# EAGLE design Numpad (EAGLE 9.3.0)
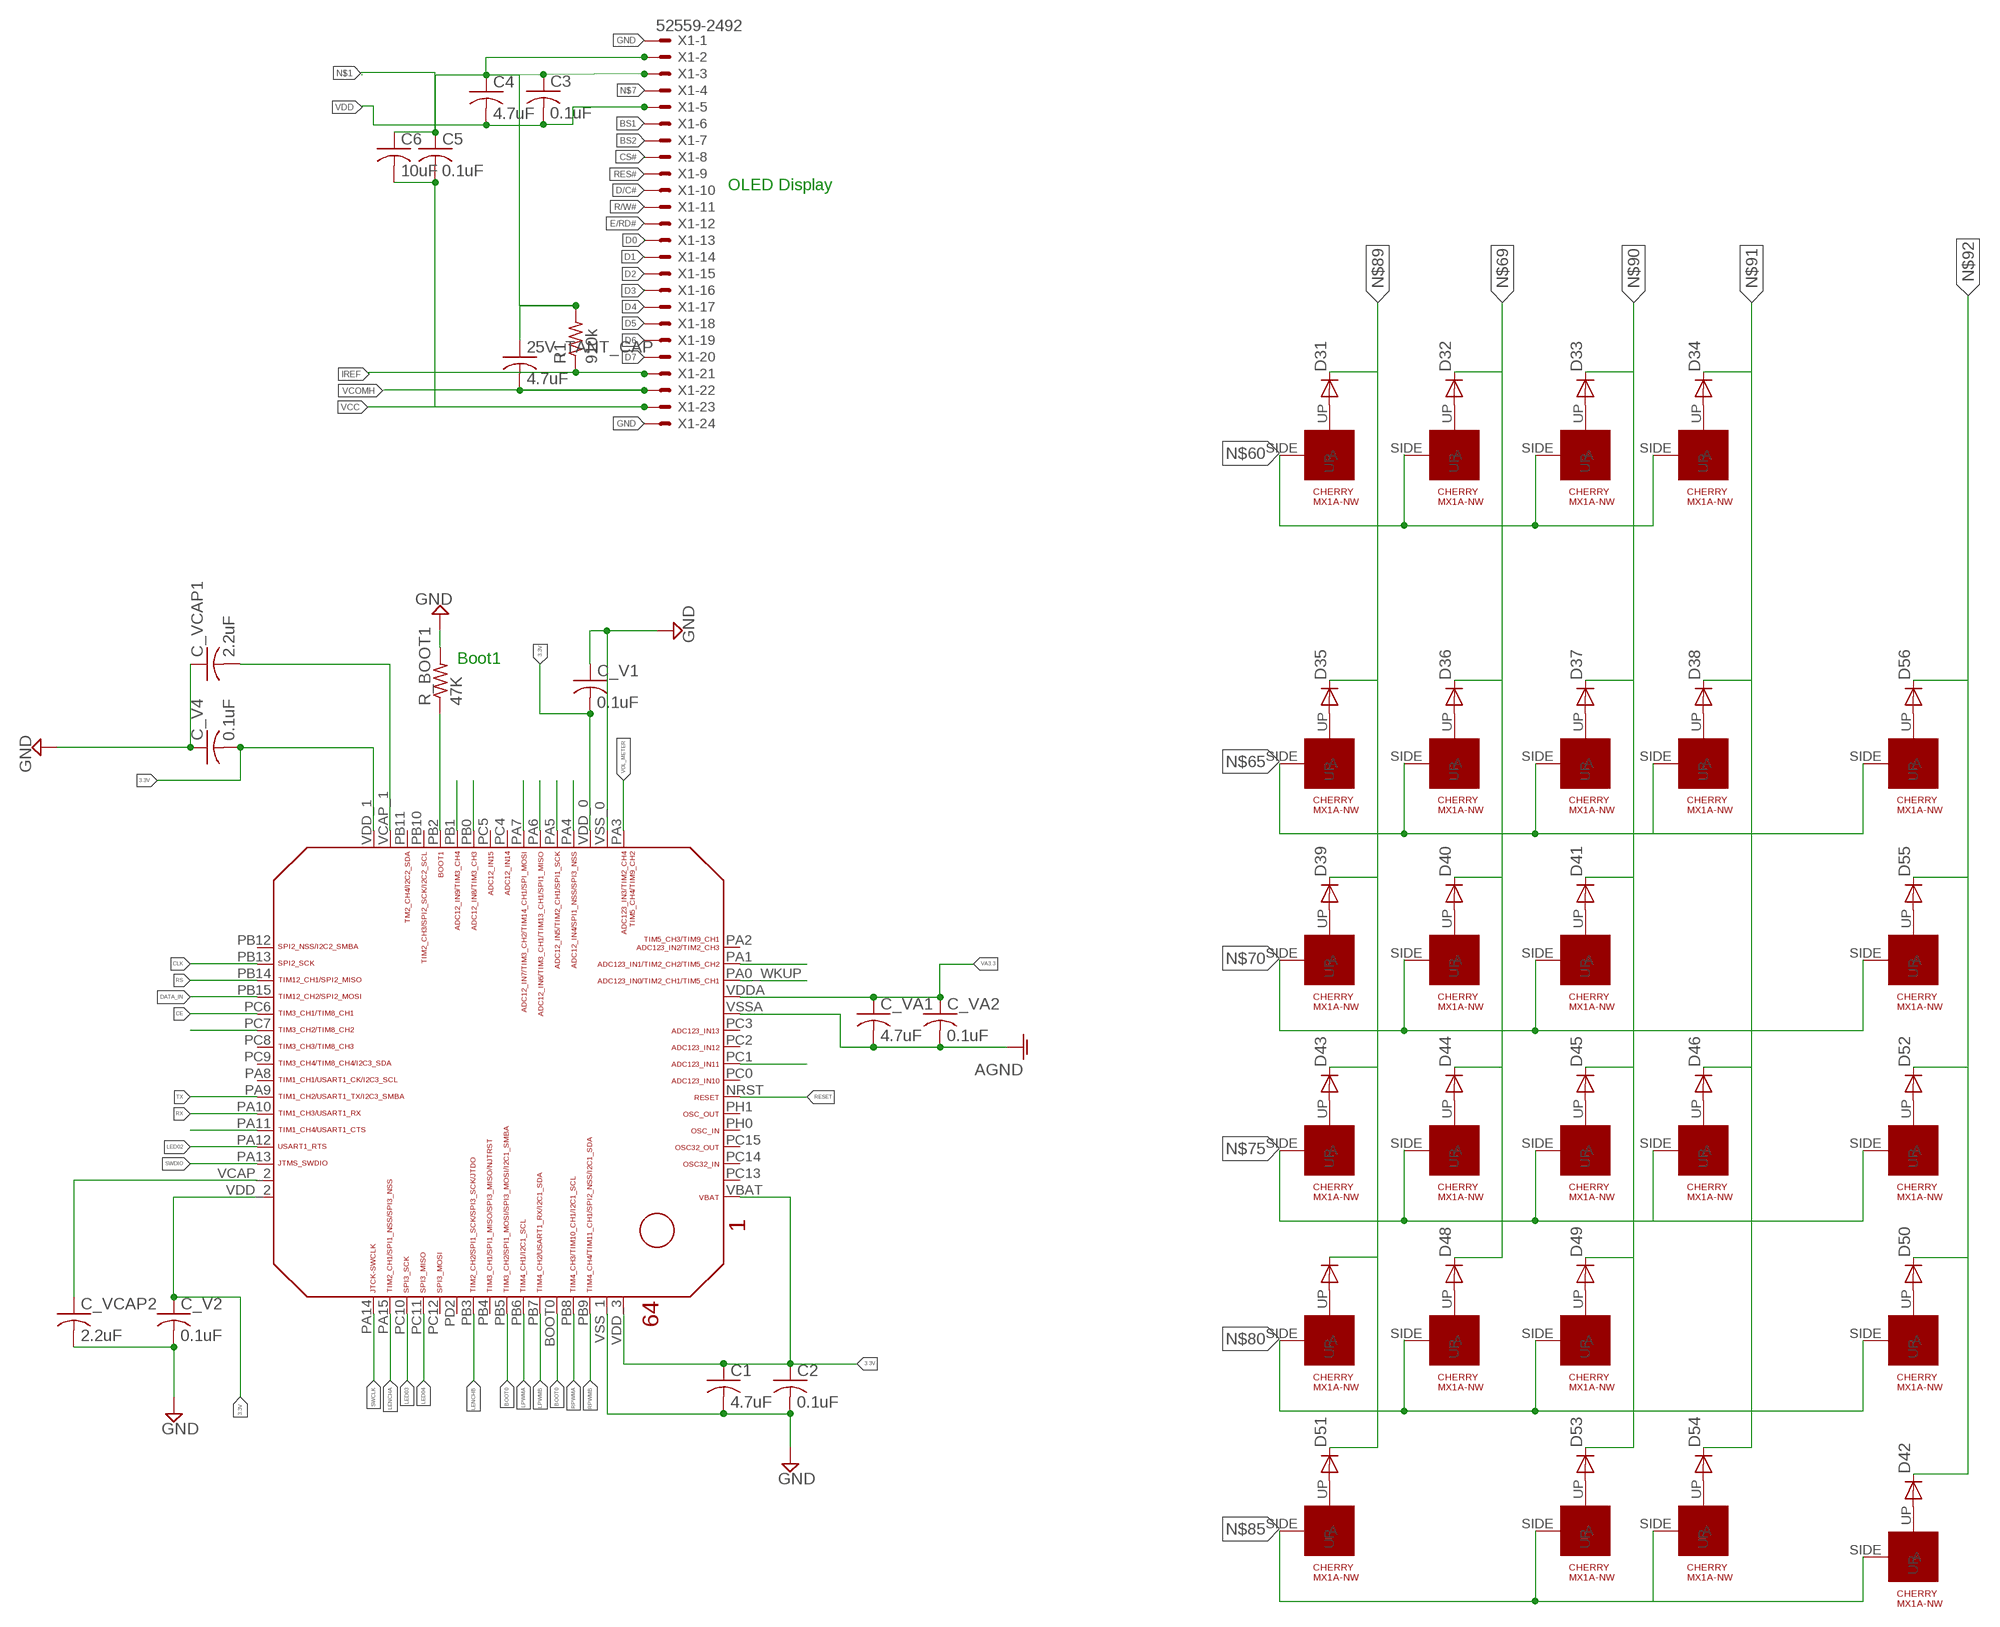
[diagram p0: schematic, sheet 1]

## Parts
25V_TANT_CAP  4.7uF  C-USC0805  [C0805]
C1  4.7uF  C-USC0603  [C0603]
C2  0.1uF  C-USC0603  [C0603]
C3  0.1uF  C-USC0603  [C0603]
C4  4.7uF  C-USC0603  [C0603]
C5  0.1uF  C-USC0603  [C0603]
C6  10uF  C-USC0603  [C0603]
C_V1  0.1uF  C-USC0603  [C0603]
C_V2  0.1uF  C-USC0603  [C0603]
C_V4  0.1uF  C-USC0603  [C0603]
C_VA1  4.7uF  C-USC0603  [C0603]
C_VA2  0.1uF  C-USC0603  [C0603]
C_VCAP1  2.2uF  C-USC0603  [C0603]
C_VCAP2  2.2uF  C-USC0603  [C0603]
D31  1N4148DO35-7  [DO35-7]
D32  1N4148DO35-7  [DO35-7]
D33  1N4148DO35-7  [DO35-7]
D34  1N4148DO35-7  [DO35-7]
D35  1N4148DO35-7  [DO35-7]
D36  1N4148DO35-7  [DO35-7]
D37  1N4148DO35-7  [DO35-7]
D38  1N4148DO35-7  [DO35-7]
D39  1N4148DO35-7  [DO35-7]
D40  1N4148DO35-7  [DO35-7]
D41  1N4148DO35-7  [DO35-7]
D42  1N4148DO35-7  [DO35-7]
D43  1N4148DO35-7  [DO35-7]
D44  1N4148DO35-7  [DO35-7]
D45  1N4148DO35-7  [DO35-7]
D46  1N4148DO35-7  [DO35-7]
D47  1N4148DO35-7  [DO35-7]
D48  1N4148DO35-7  [DO35-7]
D49  1N4148DO35-7  [DO35-7]
D50  1N4148DO35-7  [DO35-7]
D51  1N4148DO35-7  [DO35-7]
D52  1N4148DO35-7  [DO35-7]
D53  1N4148DO35-7  [DO35-7]
D54  1N4148DO35-7  [DO35-7]
D55  1N4148DO35-7  [DO35-7]
D56  1N4148DO35-7  [DO35-7]
R1  910k  R-US_R0603  [R0603]
R_BOOT1  47K  R-US_R0603  [R0603]
U$31  CHERRY-MX1A-E1NW  [CHERRYMX-NN]
U$35  STM32F405/415_LQFP64  [STM32F405/415_LQFP64]
U$36  CHERRY-MX1A-E1NW  [CHERRYMX-NN]
U$37  CHERRY-MX1A-E1NW  [CHERRYMX-NN]
U$38  CHERRY-MX1A-E1NW  [CHERRYMX-NN]
U$39  CHERRY-MX1A-E1NW  [CHERRYMX-NN]
U$40  CHERRY-MX1A-E1NW  [CHERRYMX-NN]
U$41  CHERRY-MX1A-E1NW  [CHERRYMX-NN]
U$42  CHERRY-MX1A-E1NW  [CHERRYMX-NN]
U$43  CHERRY-MX1A-E1NW  [CHERRYMX-NN]
U$44  CHERRY-MX1A-E1NW  [CHERRYMX-NN]
U$45  CHERRY-MX1A-E1NW  [CHERRYMX-NN]
U$46  CHERRY-MX1A-E1NW  [CHERRYMX-NN]
U$47  CHERRY-MX1A-E1NW  [CHERRYMX-NN]
U$48  CHERRY-MX1A-E1NW  [CHERRYMX-NN]
U$49  CHERRY-MX1A-E1NW  [CHERRYMX-NN]
U$50  CHERRY-MX1A-E1NW  [CHERRYMX-NN]
U$51  CHERRY-MX1A-E1NW  [CHERRYMX-NN]
U$52  CHERRY-MX1A-E1NW  [CHERRYMX-NN]
U$53  CHERRY-MX1A-E1NW  [CHERRYMX-NN]
U$54  CHERRY-MX1A-E1NW  [CHERRYMX-NN]
U$55  CHERRY-MX1A-E1NW  [CHERRYMX-NN]
U$56  CHERRY-MX1A-E1NW  [CHERRYMX-NN]
U$57  CHERRY-MX1A-E1NW  [CHERRYMX-NN]
U$58  CHERRY-MX1A-E1NW  [CHERRYMX-NN]
U$59  CHERRY-MX1A-E1NW  [CHERRYMX-NN]
U$60  CHERRY-MX1A-E1NW  [CHERRYMX-NN]
X1  52559-2492  [52559-2492]

## Nets
3.3V: C1.1 C2.1 C_V1.2 C_V2.1 C_V4.2 U$35.VBAT U$35.VDD_0 U$35.VDD_1 U$35.VDD_2 U$35.VDD_3
AGND: C_VA1.2 C_VA2.2 U$35.VSSA
BOOT0: U$35.BOOT0 U$35.PB5
BS1: X1.6
BS2: X1.7
BUZZER: U$35.PA6
CE: U$35.PC6
CLK: U$35.PB13
CS#: X1.8
D0: X1.13
D1: X1.14
D2: X1.15
D3: X1.16
D4: X1.17
D5: X1.18
D6: X1.19
D7: X1.20
D/C#: X1.10
DATA_IN: U$35.PB15
DIAGONAL_EMITTER: U$35.PA7
E/RD#: X1.12
GND: C1.2 C2.2 C_V1.1 C_V2.2 C_V4.1 C_VCAP1.1 C_VCAP2.2 R_BOOT1.2 U$35.VSS_0 U$35.VSS_1 X1.1 X1.24
IREF: R1.1 X1.21
L_RECEIVER: U$35.PB0
LED01: U$35.PA11
LED02: U$35.PA12
LED03: U$35.PC10
LED04: U$35.PC11
LENCHA: U$35.PA15
LENCHB: U$35.PB3
LF_EMITTER: U$35.PC7
LF_RECEIVER: U$35.PB1
LPWMA: U$35.PB6
LPWMB: U$35.PB7
N$7: X1.4
N$45: R_BOOT1.1 U$35.PB2
N$54: D31.A U$31.UP
N$55: C_VCAP1.2 U$35.VCAP_1
N$56: C_VCAP2.1 U$35.VCAP_2
N$57: D32.A U$36.UP
N$58: D33.A U$37.UP
N$59: D34.A U$38.UP
N$60: U$31.SIDE(A) U$36.SIDE(A) U$37.SIDE(A) U$38.SIDE(A)
N$61: D35.A U$39.UP
N$62: D36.A U$40.UP
N$63: D37.A U$41.UP
N$64: D38.A U$42.UP
N$65: U$39.SIDE(A) U$40.SIDE(A) U$41.SIDE(A) U$42.SIDE(A) U$60.SIDE(A)
N$66: D39.A U$43.UP
N$67: D40.A U$44.UP
N$68: D41.A U$45.UP
N$69: D32.C D36.C D40.C D44.C D48.C
N$70: U$43.SIDE(A) U$44.SIDE(A) U$45.SIDE(A) U$59.SIDE(A)
N$71: D43.A U$47.UP
N$72: D44.A U$48.UP
N$73: D45.A U$49.UP
N$74: D46.A U$50.UP
N$75: U$47.SIDE(A) U$48.SIDE(A) U$49.SIDE(A) U$50.SIDE(A) U$56.SIDE(A)
N$76: D47.A U$51.UP
N$77: D48.A U$52.UP
N$78: D49.A U$53.UP
N$79: D42.A U$46.UP
N$80: U$51.SIDE(A) U$52.SIDE(A) U$53.SIDE(A) U$54.SIDE(A)
N$81: D51.A U$55.UP
N$82: D50.A U$54.UP
N$83: D53.A U$57.UP
N$84: D54.A U$58.UP
N$85: U$46.SIDE(A) U$55.SIDE(A) U$57.SIDE(A) U$58.SIDE(A)
N$86: D52.A U$56.UP
N$87: D55.A U$59.UP
N$88: D56.A U$60.UP
N$89: D31.C D35.C D39.C D43.C D47.C D51.C
N$90: D33.C D37.C D41.C D45.C D49.C D53.C
N$91: D34.C D38.C D46.C D54.C
N$92: D42.C D50.C D52.C D55.C D56.C
R/W#: X1.11
R_RECEIVER: U$35.PA5
RENCHA: U$35.PA0_WKUP(PA0_AKUP)
RENCHB: U$35.PA1
RES#: X1.9
RESET: U$35.NRST
RF_EMITTER: U$35.PC1
RF_RECEIVER: U$35.PA4
RPWMA: U$35.PB8
RPWMB: U$35.PB9
RS: U$35.PB14
RX: U$35.PA10
SWCLK: U$35.PA14
SWDIO: U$35.PA13
TX: U$35.PA9
VA3.3: C_VA1.1 C_VA2.1 U$35.VDDA
VCC: C5.2 C6.2 X1.23
VCOMH: 25V_TANT_CAP.2 X1.22
VDD: C3.2 C4.2 X1.5
VLSS: 25V_TANT_CAP.1 C3.1 C4.1 C5.1 C6.1 R1.2 X1.2 X1.3
VOL_METER: U$35.PA3
Unconnected: U$35.PA2 U$35.PA8 U$35.PB4 U$35.PB10 U$35.PB11 U$35.PB12 U$35.PC0 U$35.PC2 U$35.PC3 U$35.PC4 U$35.PC5 U$35.PC8 U$35.PC9 U$35.PC12 U$35.PC13 U$35.PC14 U$35.PC15 U$35.PD2 U$35.PH0 U$35.PH1

## Notes on the sheet
- OLED Display
- Boot1

## Library data of the parts
25V_TANT_CAP = rcl:C-US: CAPACITOR, American symbol; SPICEPREFIX: C
C1-C6 C_V1 C_V2 C_V4 C_VA1 C_VA2 C_VCAP1 C_VCAP2 = resistor:C-US: CAPACITOR, American symbol
D31-D56 = diode:1N4148: DIODE high speed (Philips)
R1 R_BOOT1 = resistor:R-US_: RESISTOR, American symbol
U$31 U$36-U$60 = my_parts:CHERRY-MX1A-E1NW: Cherry MX NW key
U$35 = STM32F10x F4xx:STM32F405/415_LQFP64
X1 = con-molex:52559-2492: FFC/FPC-to-Board 0.50mm (.020") SMT, Vertical, ZIF Receptacle Source: http://www.molex.com/product/ffc/52559.html; MF: MOLEX; MPN: 52559-2492; OC_FARNELL: unknown; OC_NEWARK: 25M4409

## Board
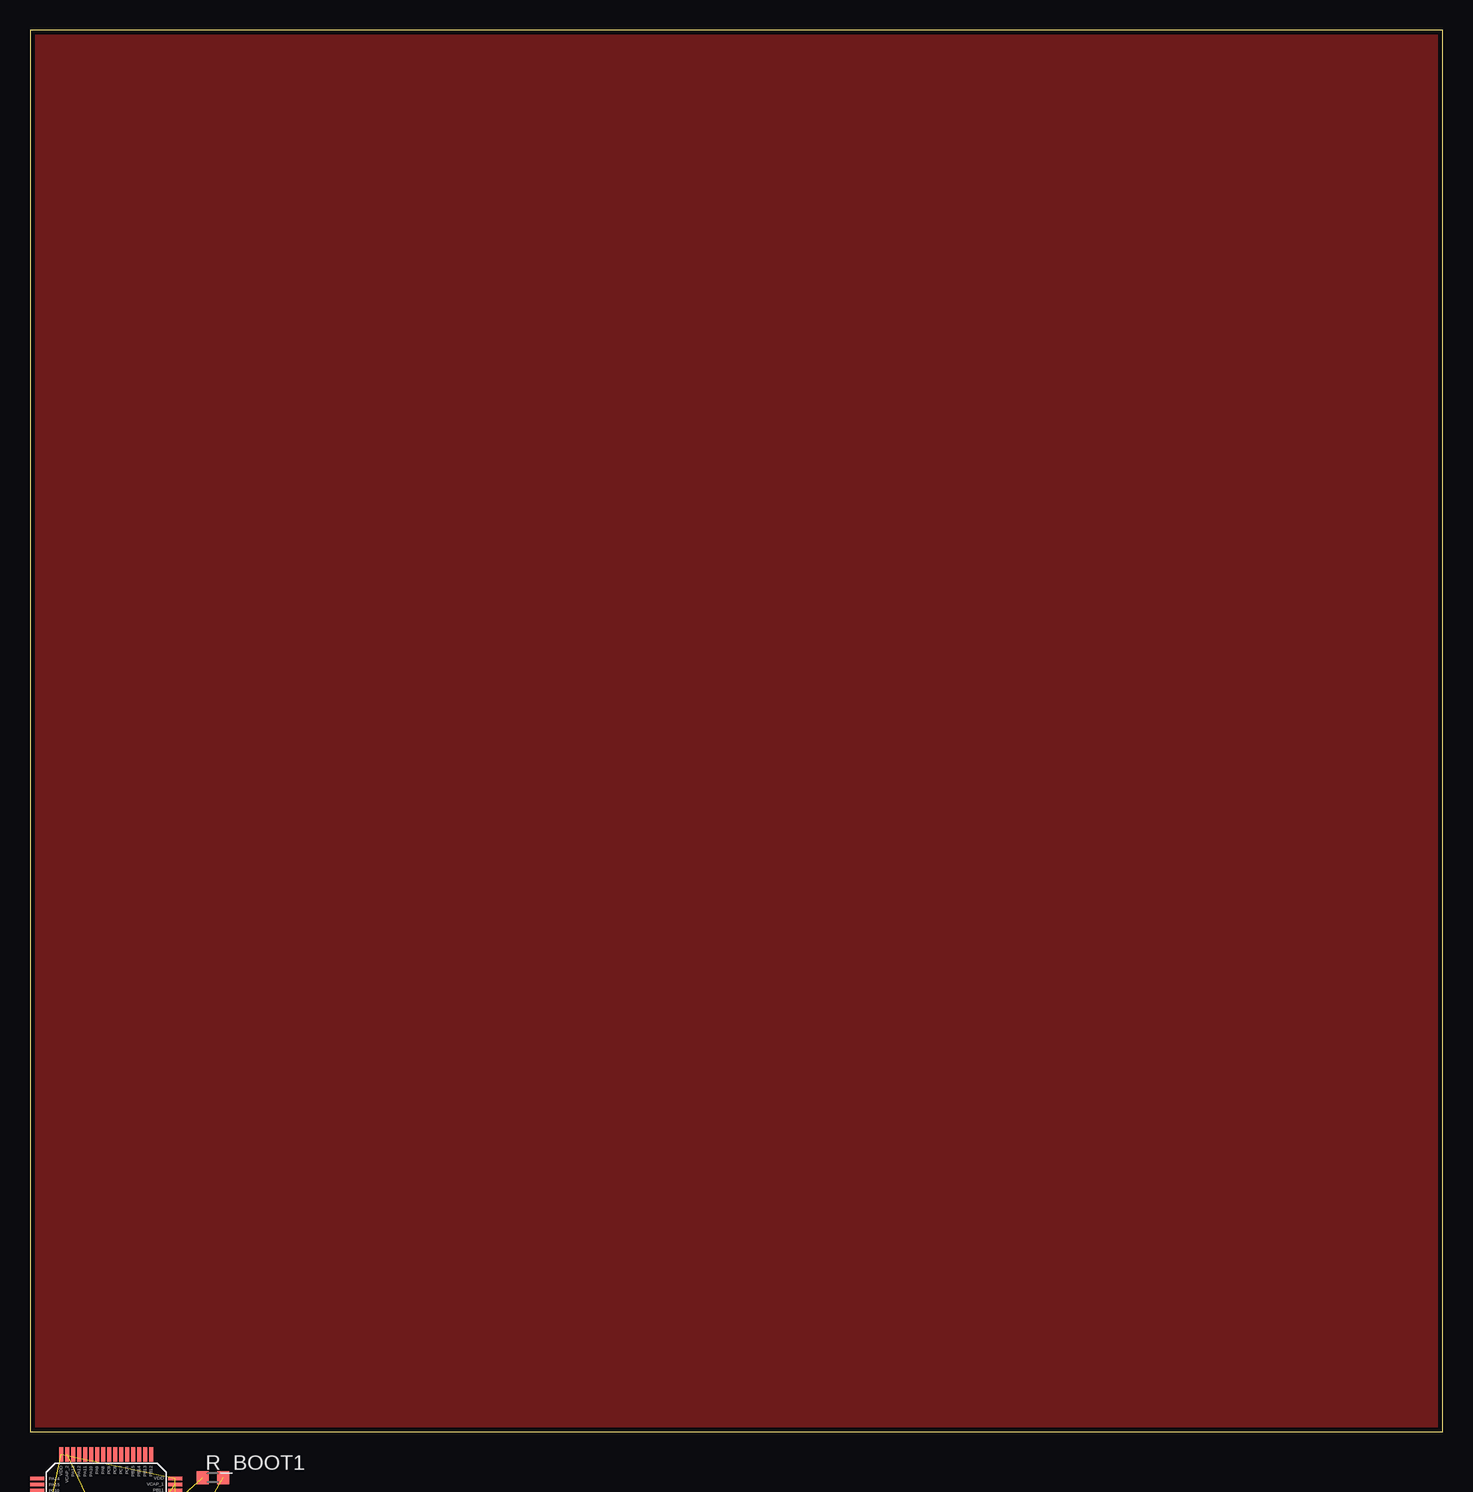
[diagram p1: board, top side]
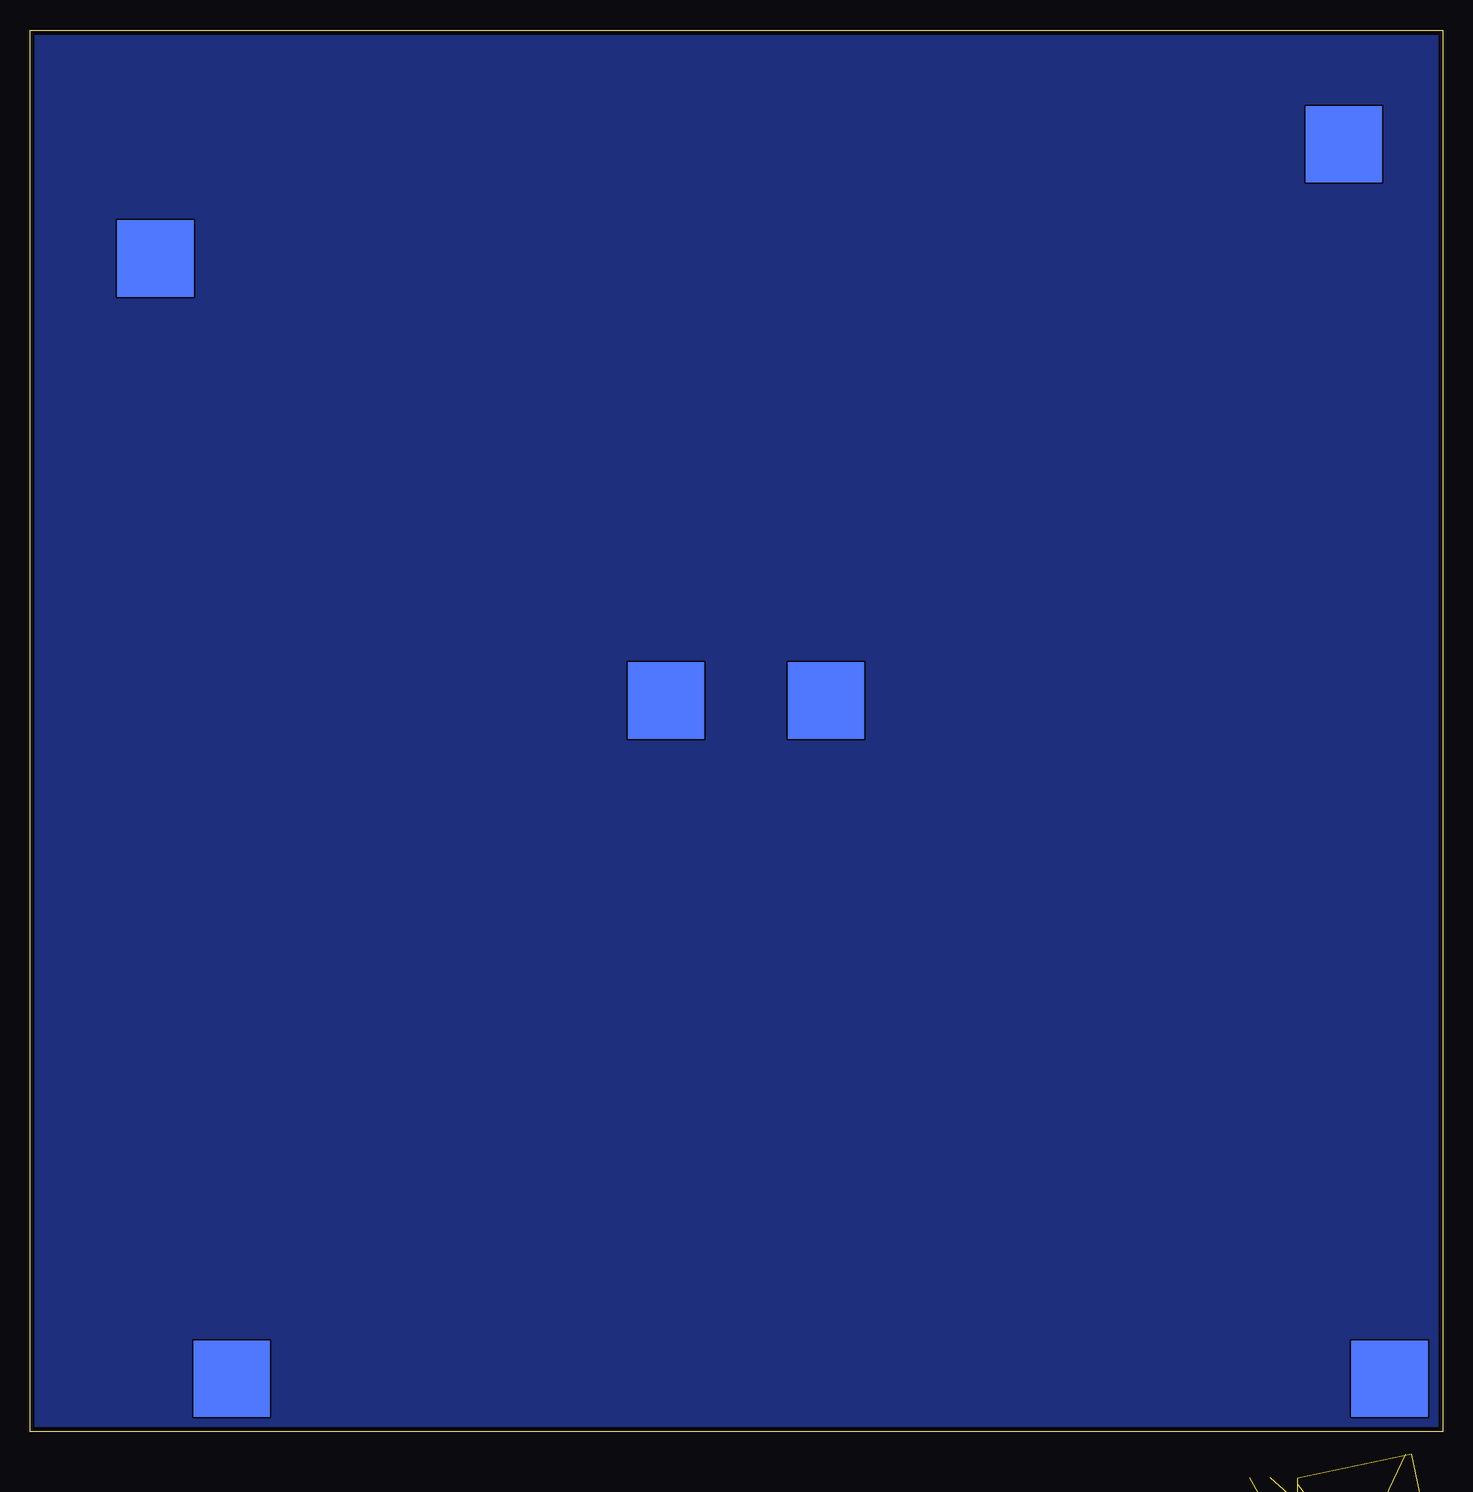
[diagram p2: board, bottom side, seen from below]

Size 117.78 x 116.83 mm. Coordinates in mm from the lower left corner, seen from the top.
Outline: 0,0 117.78,0 117.78,116.83 0,116.83 0,0
Copper layers (1*16): Top 0.0356mm / dielectric 1.5011mm / Bottom 0.0356mm
Design rules "LaenPCBOrder": minimum track width 6mil, minimum drill 13mil, track to track 6mil, track to pad 6mil, pad to pad 6mil, via to via 6mil, smd to smd 6mil, copper to edge 15mil, drill to drill 6mil, minimum pad ring 7mil, minimum via ring 7mil, stop-mask expansion 4mil, vias tented up to drill 0mil, thermal gap 10mil

### Footprints (pad centres in the part's own frame; a part is rotated, then mirrored left to right if it is on the bottom)
C0805 = smd 1.3 x 1.5: 1 -0.95,0; 2 0.95,0
C0603 = smd 1.1 x 1: 1 -0.85,0; 2 0.85,0
DO35-7 = drill 0.813 long: A 3.81,0; C -3.81,0
R0603 = smd 1 x 1.1: 1 -0.85,0; 2 0.85,0
CHERRYMX-NN = drill 1.6 square: SIDE -3.81,2.54; UP 2.54,5.08 | hole 1.753: -5.08,0; 5.08,0 | hole 4.089: 0,0
STM32F405/415_LQFP64 = smd 1.2 x 0.3: BOOT0 -5.75,-1.75; PA3 5.75,-3.75; PA4 5.75,-2.25; PA5 5.75,-1.75; PA6 5.75,-1.25; PA7 5.75,-0.75; PA14 -5.75,3.75; PA15 -5.75,3.25; PB0 5.75,0.75; PB1 5.75,1.25; PB2 5.75,1.75; PB3 -5.75,0.75; PB4 -5.75,0.25; PB5 -5.75,-0.25; PB6 -5.75,-0.75; PB7 -5.75,-1.25; PB8 -5.75,-2.25; PB9 -5.75,-2.75; PB10 5.75,2.25; PB11 5.75,2.75; PC4 5.75,-0.25; PC5 5.75,0.25; PC10 -5.75,2.75; PC11 -5.75,2.25; PC12 -5.75,1.75; PD2 -5.75,1.25; VCAP_1 5.75,3.25; VDD_0 5.75,-2.75; VDD_1 5.75,3.75; VDD_3 -5.75,-3.75; VSS_0 5.75,-3.25; VSS_1 -5.75,-3.25 | smd 0.3 x 1.2: NRST -0.75,-5.75; PA0_WKUP 2.75,-5.75; PA1 3.25,-5.75; PA2 3.75,-5.75; PA8 -0.25,5.75; PA9 -0.75,5.75; PA10 -1.25,5.75; PA11 -1.75,5.75; PA12 -2.25,5.75; PA13 -2.75,5.75; PB12 3.75,5.75; PB13 3.25,5.75; PB14 2.75,5.75; PB15 2.25,5.75; PC0 -0.25,-5.75; PC1 0.25,-5.75; PC2 0.75,-5.75; PC3 1.25,-5.75; PC6 1.75,5.75; PC7 1.25,5.75; PC8 0.75,5.75; PC9 0.25,5.75; PC13 -3.25,-5.75; PC14 -2.75,-5.75; PC15 -2.25,-5.75; PH0 -1.75,-5.75; PH1 -1.25,-5.75; VBAT -3.75,-5.75; VCAP_2 -3.25,5.75; VDD_2 -3.75,5.75; VDDA 2.25,-5.75; VSSA 1.75,-5.75
52559-2492 = smd 0.6 x 1.5: 1 -5.75,-1.4; 2 -5.25,1.4; 3 -4.75,-1.4; 4 -4.25,1.4; 5 -3.75,-1.4; 6 -3.25,1.4; 7 -2.75,-1.4; 8 -2.25,1.4; 9 -1.75,-1.4; 10 -1.25,1.4; 11 -0.75,-1.4; 12 -0.25,1.4; 13 0.25,-1.4; 14 0.75,1.4; 15 1.25,-1.4; 16 1.75,1.4; 17 2.25,-1.4; 18 2.75,1.4; 19 3.25,-1.4; 20 3.75,1.4; 21 4.25,-1.4; 22 4.75,1.4; 23 5.25,-1.4; 24 5.75,1.4 | smd 0.8 x 1.5: M1 -6.75,-1.4; M2 6.75,-1.4; M3 6.75,1.4; M4 -6.75,1.4

### Placement (x,y rotation side)
25V_TANT_CAP  2.54,-482.6 0 top  (outside the outline)
C1  16.51,-22.86 0 top  (outside the outline)
C2  1.27,-27.94 0 top  (outside the outline)
C3  1.27,-457.2 0 top  (outside the outline)
C4  1.27,-461.01 0 top  (outside the outline)
C5  1.27,-464.82 0 top  (outside the outline)
C6  1.27,-468.63 0 top  (outside the outline)
C_V1  7.62,-27.94 0 top  (outside the outline)
C_V2  13.97,-27.94 0 top  (outside the outline)
C_V4  1.27,-33.02 0 top  (outside the outline)
C_VA1  1.27,-22.86 0 top  (outside the outline)
C_VA2  8.89,-22.86 0 top  (outside the outline)
C_VCAP1  1.27,-17.78 0 top  (outside the outline)
C_VCAP2  11.43,-17.78 0 top  (outside the outline)
D31  5.08,-48.26 0 top  (outside the outline)
D32  5.08,-86.36 0 top  (outside the outline)
D33  5.08,-107.95 0 top  (outside the outline)
D34  5.08,-129.54 0 top  (outside the outline)
D35  5.08,-167.64 0 top  (outside the outline)
D36  16.51,-167.64 0 top  (outside the outline)
D37  27.94,-167.64 0 top  (outside the outline)
D38  5.08,-172.72 0 top  (outside the outline)
D39  5.08,-210.82 0 top  (outside the outline)
D40  16.51,-210.82 0 top  (outside the outline)
D41  27.94,-210.82 0 top  (outside the outline)
D42  5.08,-367.03 0 top  (outside the outline)
D43  5.08,-254 0 top  (outside the outline)
D44  16.51,-254 0 top  (outside the outline)
D45  27.94,-254 0 top  (outside the outline)
D46  5.08,-259.08 0 top  (outside the outline)
D47  5.08,-297.18 0 top  (outside the outline)
D48  16.51,-297.18 0 top  (outside the outline)
D49  27.94,-297.18 0 top  (outside the outline)
D50  5.08,-388.62 0 top  (outside the outline)
D51  5.08,-340.36 0 top  (outside the outline)
D52  5.08,-410.21 0 top  (outside the outline)
D53  27.94,-340.36 0 top  (outside the outline)
D54  5.08,-345.44 0 top  (outside the outline)
D55  5.08,-431.8 0 top  (outside the outline)
D56  5.08,-453.39 0 top  (outside the outline)
R1  1.27,-476.25 0 top  (outside the outline)
R_BOOT1  15.24,-3.81 0 top  (outside the outline)
U$31  8.89,-58.42 0 top  (outside the outline)
U$35  6.35,-7.62 0 top
U$36  8.89,-74.93 0 top  (outside the outline)
U$37  8.89,-96.52 0 top  (outside the outline)
U$38  8.89,-118.11 0 top  (outside the outline)
U$39  8.89,-139.7 0 top  (outside the outline)
U$40  25.4,-139.7 0 top  (outside the outline)
U$41  8.89,-156.21 0 top  (outside the outline)
U$42  25.4,-156.21 0 top  (outside the outline)
U$43  8.89,-182.88 0 top  (outside the outline)
U$44  25.4,-182.88 0 top  (outside the outline)
U$45  8.89,-199.39 0 top  (outside the outline)
U$46  8.89,-355.6 0 top  (outside the outline)
U$47  8.89,-226.06 0 top  (outside the outline)
U$48  25.4,-226.06 0 top  (outside the outline)
U$49  8.89,-242.57 0 top  (outside the outline)
U$50  25.4,-242.57 0 top  (outside the outline)
U$51  8.89,-269.24 0 top  (outside the outline)
U$52  25.4,-269.24 0 top  (outside the outline)
U$53  8.89,-285.75 0 top  (outside the outline)
U$54  8.89,-377.19 0 top  (outside the outline)
U$55  8.89,-312.42 0 top  (outside the outline)
U$56  8.89,-398.78 0 top  (outside the outline)
U$57  8.89,-328.93 0 top  (outside the outline)
U$58  25.4,-328.93 0 top  (outside the outline)
U$59  8.89,-420.37 0 top  (outside the outline)
U$60  8.89,-441.96 0 top  (outside the outline)
X1  8.89,-40.64 0 top  (outside the outline)

### Tracks (layer width: path | path; a pad name or v marks a point on that pad's centre or on a via)
3.3V  (9 unrouted)
AGND  (2 unrouted)
BOOT0  (1 unrouted)
GND  (11 unrouted)
  pour Bottom: 0,116.84 118.11,116.84 118.11,0 0,0
  pour Top: 0,116.84 118.11,116.84 118.11,0 0,0
IREF  (1 unrouted)
N$45  (1 unrouted)
N$54  (1 unrouted)
N$55  (1 unrouted)
N$56  (1 unrouted)
N$57  (1 unrouted)
N$58  (1 unrouted)
N$59  (1 unrouted)
N$60  (3 unrouted)
N$61  (1 unrouted)
N$62  (1 unrouted)
N$63  (1 unrouted)
N$64  (1 unrouted)
N$65  (4 unrouted)
N$66  (1 unrouted)
N$67  (1 unrouted)
N$68  (1 unrouted)
N$69  (4 unrouted)
N$70  (3 unrouted)
N$71  (1 unrouted)
N$72  (1 unrouted)
N$73  (1 unrouted)
N$74  (1 unrouted)
N$75  (4 unrouted)
N$76  (1 unrouted)
N$77  (1 unrouted)
N$78  (1 unrouted)
N$79  (1 unrouted)
N$80  (3 unrouted)
N$81  (1 unrouted)
N$82  (1 unrouted)
N$83  (1 unrouted)
N$84  (1 unrouted)
N$85  (3 unrouted)
N$86  (1 unrouted)
N$87  (1 unrouted)
N$88  (1 unrouted)
N$89  (5 unrouted)
N$90  (5 unrouted)
N$91  (3 unrouted)
N$92  (4 unrouted)
VA3.3  (2 unrouted)
VCC  (2 unrouted)
VCOMH  (1 unrouted)
VDD  (2 unrouted)
VLSS  (7 unrouted)
(copper drawn outside any net)
  shapes: Bottom area x6